# Altium schematic sheet power.SchDoc
size A3
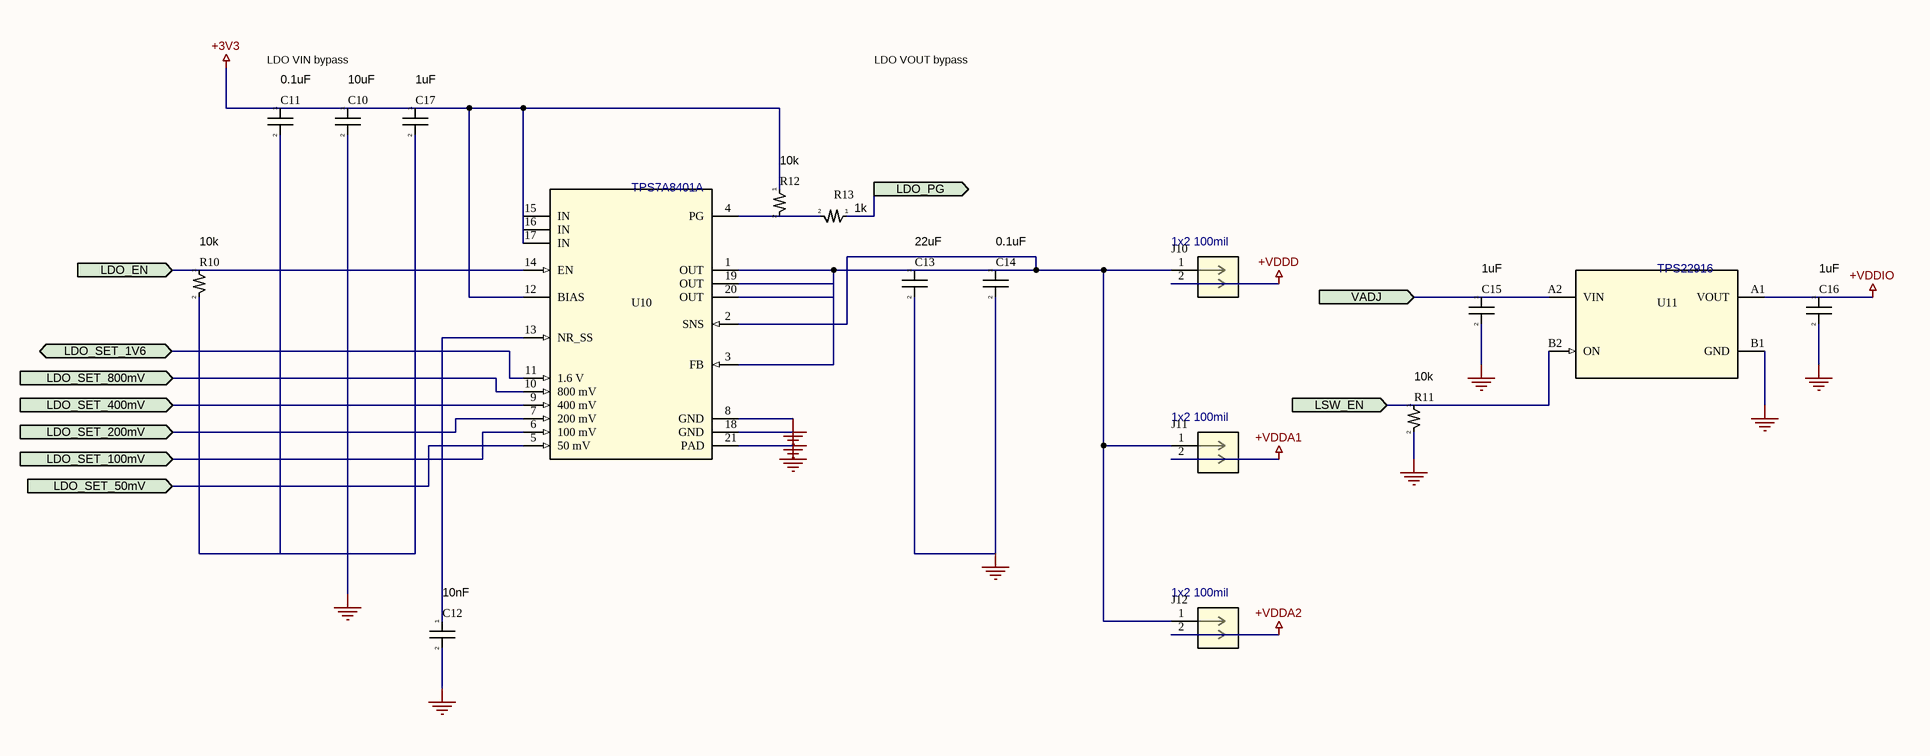
[diagram p0: power.SchDoc]

## Parts
C10  10uF
C11  0.1uF
C12  10nF
C13  22uF
C14  0.1uF
C15  1uF
C16  1uF
C17  1uF
J10  1x2 100mil
J11  1x2 100mil
J12  1x2 100mil
R10  10k
R11  10k
R12  10k
R13  1k
U10  TPS7A8401A
U11  TPS22916

## Ports
LDO_EN (in), LDO_PG (out), LDO_SET_1V6 (in), LDO_SET_50mV (in), LDO_SET_100mV (in), LDO_SET_200mV (in), LDO_SET_400mV (in), LDO_SET_800mV (in), LSW_EN (in), VADJ (in)

## Nets
+3V3: C10.1 C11.1 C17.1 R12.1 U10.12(BIAS) U10.15(IN) U10.16(IN) U10.17(IN)
+VDDA1: J11.2
+VDDA2: J12.2
+VDDD: J10.2
+VDDIO: C16.1 U11.A1(VOUT)
GND: C10.2 C11.2 C12.2 C13.2 C14.2 C15.2 C16.2 C17.2 R10.2 R11.2 U10.8(GND) U10.18(GND) U10.21(PAD) U11.B1(GND)
LDO_EN: R10.1 U10.14(EN) ; port LDO_EN
LDO_PG: R13.1 ; port LDO_PG
LDO_SET_1V6: U10.11(1.6_V) ; port LDO_SET_1V6
LDO_SET_50mV: U10.5(50_mV) ; port LDO_SET_50mV
LDO_SET_100mV: U10.6(100_mV) ; port LDO_SET_100mV
LDO_SET_200mV: U10.7(200_mV) ; port LDO_SET_200mV
LDO_SET_400mV: U10.9(400_mV) ; port LDO_SET_400mV
LDO_SET_800mV: U10.10(800_mV) ; port LDO_SET_800mV
LSW_EN: R11.1 U11.B2(ON) ; port LSW_EN
VADJ: C15.1 U11.A2(VIN) ; port VADJ
NetC12_1: C12.1 U10.13(NR_SS)
NetC13_1: C13.1 C14.1 J10.1 J11.1 J12.1 U10.1(OUT) U10.2(SNS) U10.3(FB) U10.19(OUT) U10.20(OUT)
NetR12_2: R12.2 R13.2 U10.4(PG)

## Notes on the sheet
- LDO VIN bypass
- LDO VOUT bypass

## Library data of the parts
C10 = GRM21BR71A106KA73L: Manufacturer_Name: Murata; Manufacturer_Part_Number: GRM21BR71A106KA73L
C11 C14 = GRM155R71C104KA88D: CAP CER 0.1UF 16V X7R 0402; Manufacturer_Name: Murata; Manufacturer_Part_Number: GRM155R71C104KA88D
C12 = GRM155R71H103KA88D: Manufacturer_Name: Murata; Manufacturer_Part_Number: GRM155R71H103KA88D
C13 = GRM21BR61A226ME44L: Manufacturer_Name: Murata; Manufacturer_Part_Number: GRM21BR61A226ME44L
C15-C17 = GRM155R70J105KA12D: Manufacturer_Name: Murata; Manufacturer_Part_Number: GRM155R70J105KA12D
J10-J12 = TSW-102-05-G-S: No Description Available; Manufacturer_Name: Samtec Inc; Copyright: Copyright (C) 2026 Ultra Librarian. All rights reserved.; Manufacturer_Part_Number: TSW-102-05-G-S; RefDes: RefDes; Type: Type
R10-R12 = CR0402-FX-1002GLF: Manufacturer_Name: Bourns Electronics; Manufacturer_Part_Number: CR0402-FX-1002GLF
R13 = CR0402-FX-1001GLF: Manufacturer_Name: Bourns Electronics; Manufacturer_Part_Number: CR0402-FX-1001GLF
U10 = TPS7A8401ARGRR: 3-A, low-VIN (1.1-V), low-noise, high-accuracy, ultra-low-dropout voltage regulator with power good 20-VQFN -40 to 125; Manufacturer_Name: Texas Instruments; TYPE: TYPE; RefDes: RefDes; Copyright: Copyright (C) 2025 Ultra Librarian. All rights reserved.; Manufacturer_Part_Number: TPS7A8401ARGRR
U11 = TPS22916CNYFPR: 5.5-V, 2-A, 60-mΩ, 10-nA leakage load switch with output discharge 4-DSBGA -40 to 85; Manufacturer_Name: Texas Instruments; Description: 5.5-V, 2-A, 60-mÎ©, 10-nA leakage load switch with output discharge 4-DSBGA -40 to 85; TYPE: TYPE; RefDes: RefDes; Copyright: Copyright (C) 2026 Ultra Librarian. All rights reserved.; Manufacturer_Part_Number: TPS22916CNYFPR